# EAGLE design board (EAGLE 6.5.0)
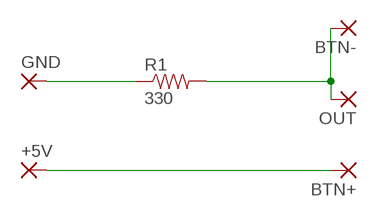
[diagram p0: schematic, sheet 1]

## Parts
+5V  2,54/1,0  [2,54/1,0]
BTN+  2,54/1,0  [2,54/1,0]
BTN-  2,54/1,0  [2,54/1,0]
GND  2,54/1,0  [2,54/1,0]
OUT  2,54/1,0  [2,54/1,0]
R1  330  RESISTORPTH-1/4W  [AXIAL-0.4]

## Nets
N$1: GND.1(P) R1.P$1
N$2: BTN-.1(P) OUT.1(P) R1.P$2
N$3: +5V.1(P) BTN+.1(P)

## Library data of the parts
+5V BTN+ BTN- GND OUT = wirepad:2,54/1,0: THROUGH-HOLE PAD
R1 = SparkFun-Resistors:RESISTOR: Resistor Basic schematic elements and footprints for 0603, 1206, and PTH resistors.

## Board
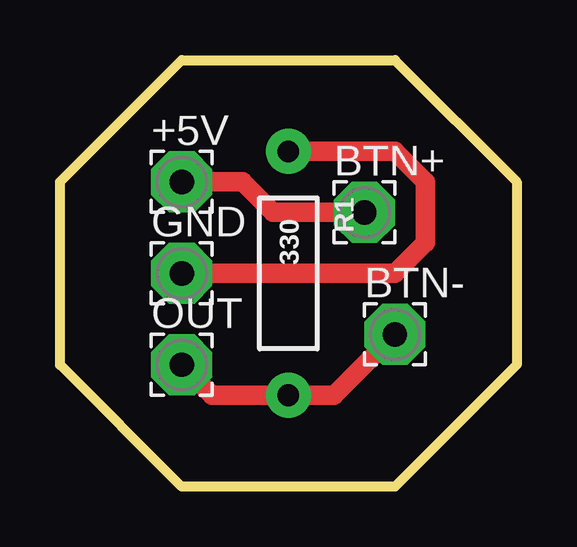
[diagram p1: board, top side]

Size 19.05 x 17.78 mm. Coordinates in mm from the lower left corner, seen from the top.
Outline: 5.08,17.78 13.97,17.78 19.05,12.7 19.05,5.08 13.97,0 5.08,0 0,5.08 0,12.7 5.08,17.78
Copper layers (1*16): Top 0.035mm / dielectric 1.5mm / Bottom 0.035mm
Design rules "default *": minimum track width 32mil, minimum drill 32mil, track to track 12mil, track to pad 12mil, pad to pad 12mil, via to via 12mil, smd to smd 8mil, copper to edge 40mil, drill to drill 8mil, minimum pad ring 10mil, minimum via ring 8mil, stop-mask expansion 4mil, vias tented up to drill 0mil, thermal gap 10mil

### Footprints (pad centres in the part's own frame; a part is rotated, then mirrored left to right if it is on the bottom)
2,54/1,0 = drill 1.016 pad 2.54 octagon: 1 0,0
AXIAL-0.4 = drill 0.9 pad 1.88: P$1 -5.08,0; P$2 5.08,0

### Placement (x,y rotation side)
+5V  5.08,12.7 0 top
BTN+  12.7,11.43 0 top
BTN-  13.97,6.35 0 top
GND  5.08,8.89 0 top
OUT  5.08,5.08 0 top
R1  9.53,8.89 270 top

### Tracks (layer width: path | path; a pad name or v marks a point on that pad's centre or on a via)
N$1
  Top 0.813: R1.P$1 13.97,13.97 15.24,12.7 15.24,10.16 13.97,8.89 GND.1
N$2
  Top 0.813: OUT.1 6.35,3.81 R1.P$2 11.43,3.81 BTN-.1
N$3
  Top 0.813: +5V.1 7.62,12.7 8.89,11.43 BTN+.1